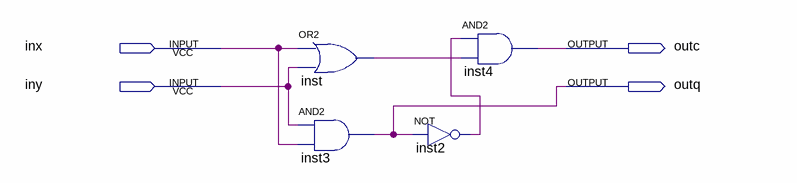
[diagram p0: schematic sheet]
// Quartus schematic SM1_Sorokin.bdf as structural Verilog: 4 symbols, 4 pins
module SM1_Sorokin (
  input  inx,
  input  iny,
  output outc,
  output outq
);

  wire inst2_out, inst_out;

  or inst (inst_out, inx, iny);
  and inst3 (outq, iny, inx);
  not inst2 (inst2_out, outq);
  and inst4 (outc, inst2_out, inst_out);
endmodule
